# EAGLE schematic Question1_Hw5 (EAGLE 9.6.2)
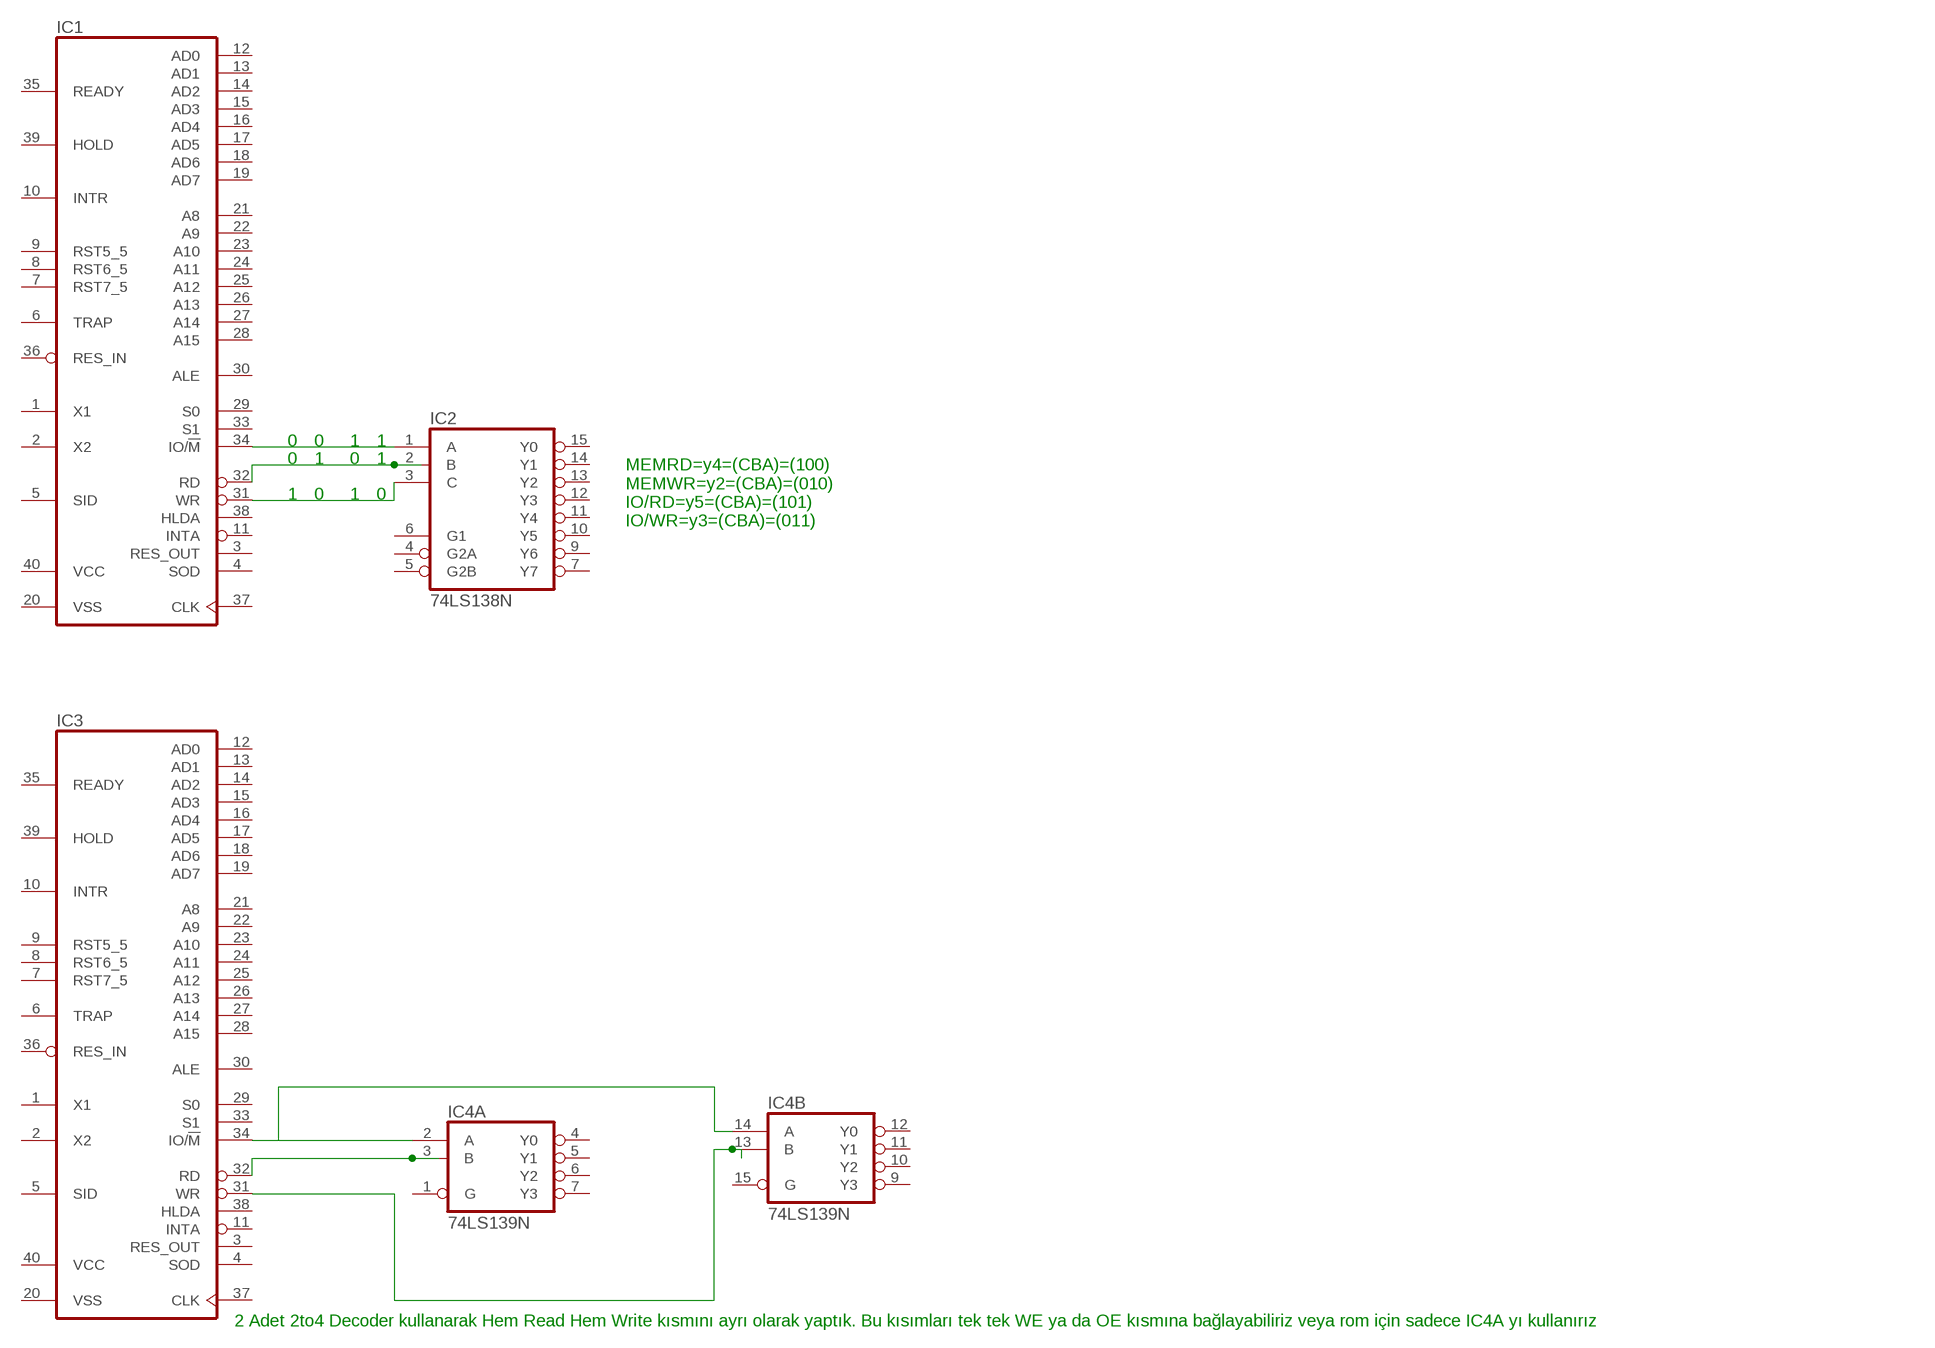
[diagram p0: schematic, sheet 1]

## Parts
IC1  8085  [DIL40]
IC2  74LS138N  [DIL16]
IC3  8085  [DIL40]
IC4  74LS139N  [DIL16]

## Nets
N$1: IC1.34(IO/!M) IC2.1(A)
N$2: IC1.32(RD) IC2.2(B)
N$3: IC1.31(WR) IC2.3(C)
N$4: IC3.34(IO/!M) IC4.2(A:A) IC4.14(B:A)
N$5: IC3.32(RD) IC4.3(A:B)
N$6: IC3.31(WR) IC4.13(B:B)
Unconnected: IC1.1(X1) IC1.2(X2) IC1.3(RES_OUT) IC1.4(SOD) IC1.5(SID) IC1.6(TRAP) IC1.7(RST7_5) IC1.8(RST6_5) IC1.9(RST5_5) IC1.10(INTR) IC1.11(INTA) IC1.12(AD0) IC1.13(AD1) IC1.14(AD2) IC1.15(AD3) IC1.16(AD4) IC1.17(AD5) IC1.18(AD6) IC1.19(AD7) IC1.21(A8) IC1.22(A9) IC1.23(A10) IC1.24(A11) IC1.25(A12) IC1.26(A13) IC1.27(A14) IC1.28(A15) IC1.29(S0) IC1.30(ALE) IC1.33(S1) IC1.35(READY) IC1.36(RES_IN) IC1.37(CLK) IC1.38(HLDA) IC1.39(HOLD) IC2.4(G2A) IC2.5(G2B) IC2.6(G1) IC2.7(Y7) IC2.9(Y6) IC2.10(Y5) IC2.11(Y4) IC2.12(Y3) IC2.13(Y2) IC2.14(Y1) IC2.15(Y0) IC3.1(X1) IC3.2(X2) IC3.3(RES_OUT) IC3.4(SOD) IC3.5(SID) IC3.6(TRAP) IC3.7(RST7_5) IC3.8(RST6_5) IC3.9(RST5_5) IC3.10(INTR) IC3.11(INTA) IC3.12(AD0) IC3.13(AD1) IC3.14(AD2) IC3.15(AD3) IC3.16(AD4) IC3.17(AD5) IC3.18(AD6) IC3.19(AD7) IC3.21(A8) IC3.22(A9) IC3.23(A10) IC3.24(A11) IC3.25(A12) IC3.26(A13) IC3.27(A14) IC3.28(A15) IC3.29(S0) IC3.30(ALE) IC3.33(S1) IC3.35(READY) IC3.36(RES_IN) IC3.37(CLK) IC3.38(HLDA) IC3.39(HOLD) IC4.1(A:G) IC4.4(A:Y0) IC4.5(A:Y1) IC4.6(A:Y2) IC4.7(A:Y3) IC4.9(B:Y3) IC4.10(B:Y2) IC4.11(B:Y1) IC4.12(B:Y0) IC4.15(B:G)

## Notes on the sheet
- 0 | 0 | 1 | 1
- 0 | 1 | 0 | 1
- 1 | 0 | 1 | 0
- MEMRD=y4=(CBA)=(100)
  MEMWR=y2=(CBA)=(010)
  IO/RD=y5=(CBA)=(101)
  IO/WR=y3=(CBA)=(011)
- 2 Adet 2to4 Decoder kullanarak Hem Read Hem Write kısmını ayrı olarak yaptık. Bu kısımları tek tek WE ya da OE kısmına bağlayabiliriz veya rom için sadece IC4A yı kullanırız

## Power pins joined to a net without a drawn wire
GND: IC2.8(GND) IC4.8(P:GND)
VCC: IC1.40(VCC) IC2.16(VCC) IC3.40(VCC) IC4.16(P:VCC)
VSS: IC1.20(VSS) IC3.20(VSS)

## Library data of the parts
IC1 IC3 = micro-intel:8085: MICROCOMPUTER/PERIPHERAL DEVICE; OC_FARNELL: unknown; OC_NEWARK: unknown
IC2 = 74xx-eu:74*138: 3-line to 8-line DECODER/DEMULTIPLEXER
IC4 = 74xx-eu:74*139: Dual 2-line to 4-line DECODER/DEMULTIPLEXER